# EAGLE schematic ddk-final-1 (EAGLE 6.4)
AUTHOR1: Dmitry Nedospasov; AUTHOR2: Thorsten Schröder; PROJECTREV: Octobus rev 0.2; WEB: http://github.com/ddk

## Sheet 1 of 5
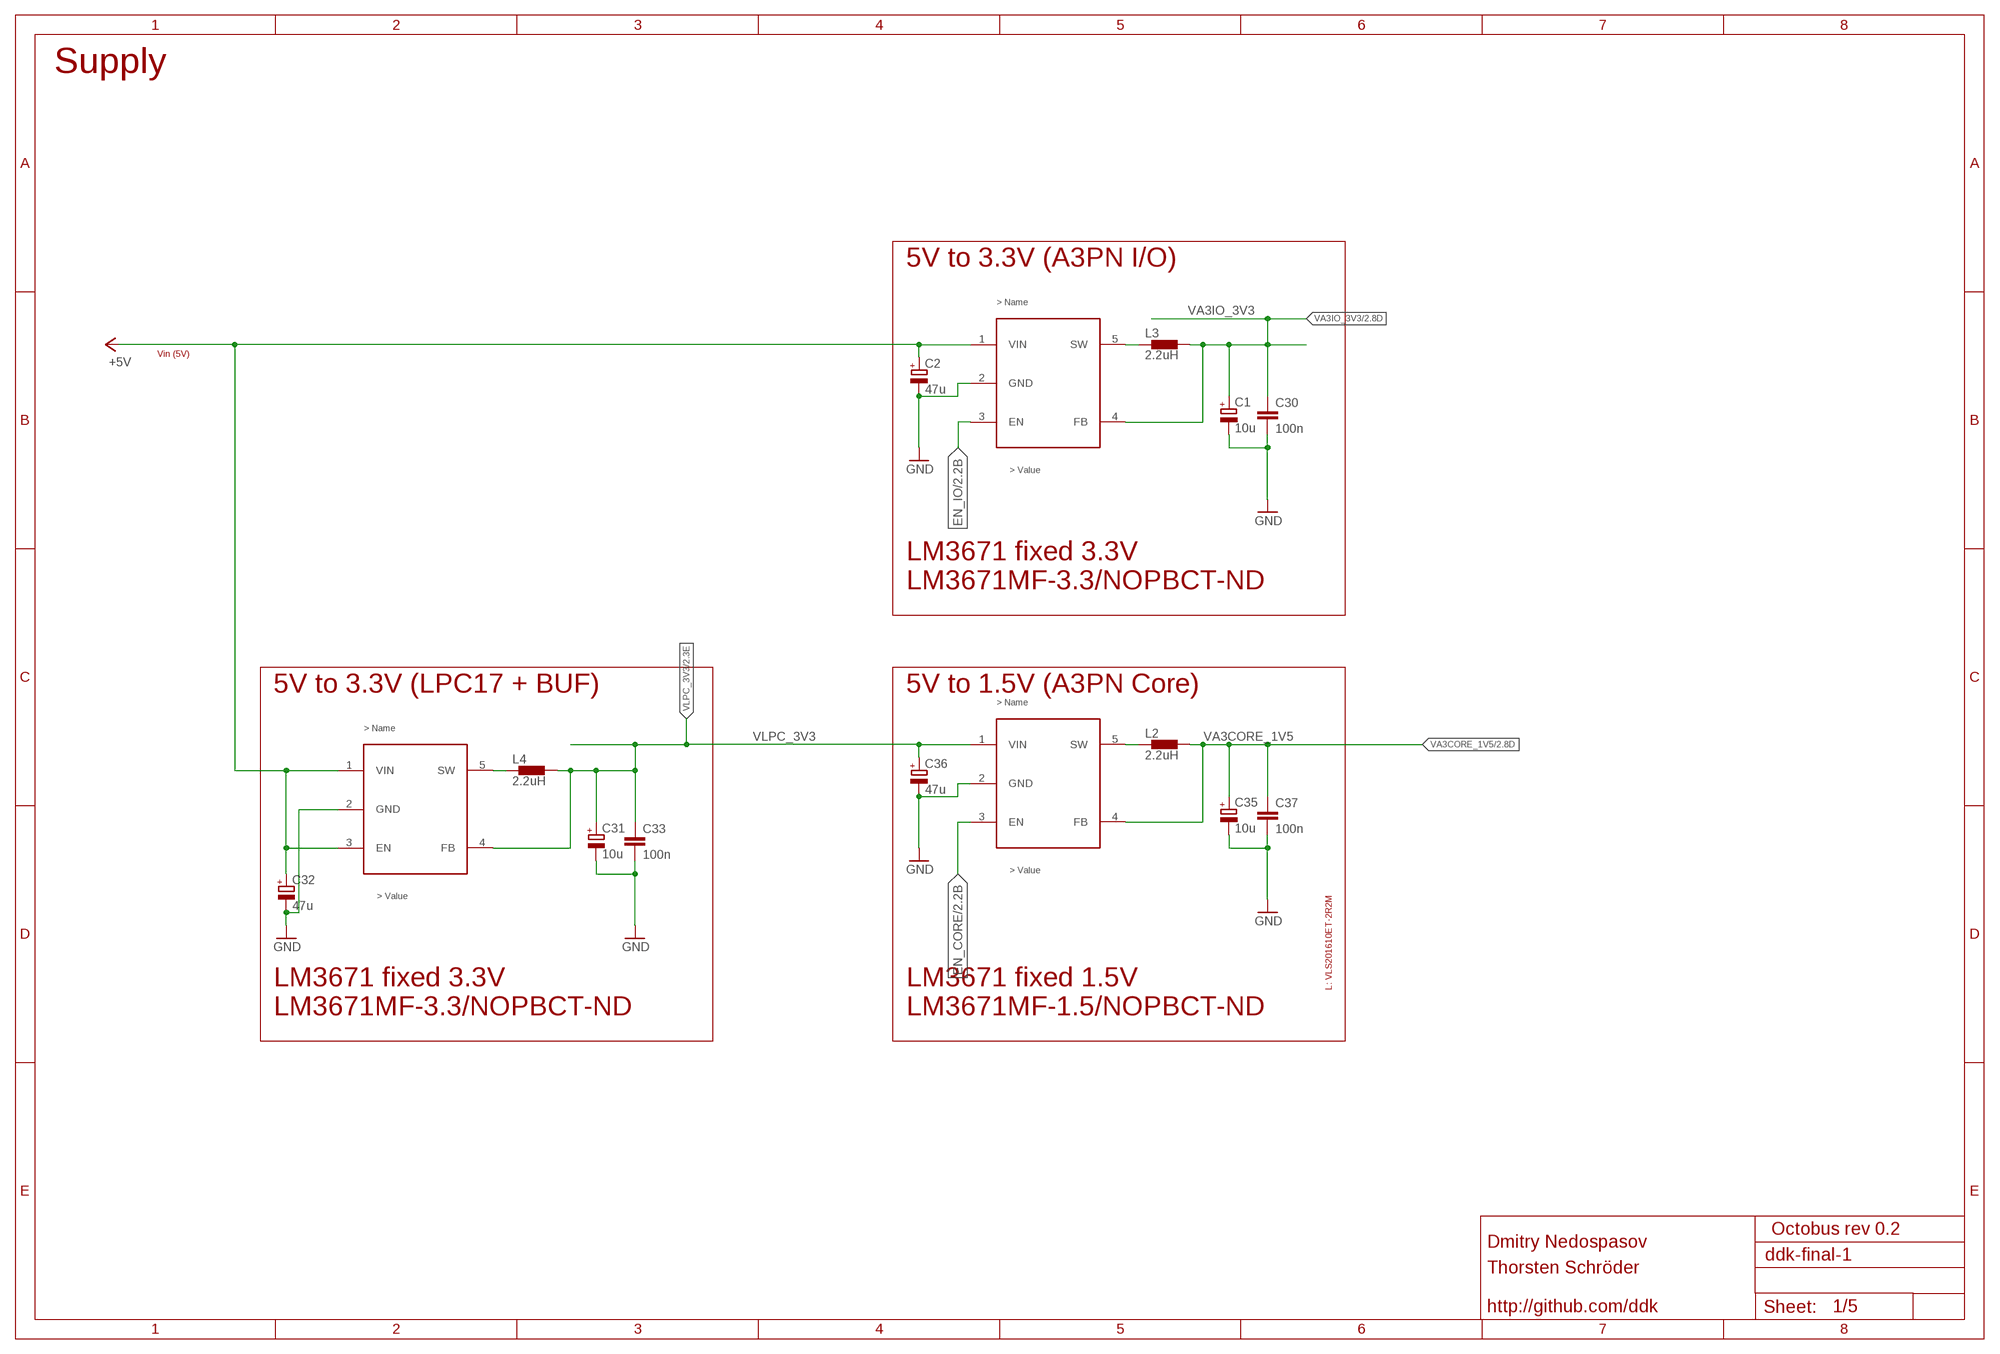
[diagram p0: schematic, sheet 1]

### Parts
C1  10u  CPOL-EUCT3216  [CT3216]
C2  47u  CPOL-EUCT3216  [CT3216]
C30  100n  C-EUC0603K  [C0603K]
C31  10u  CPOL-EUCT3216  [CT3216]
C32  47u  CPOL-EUCT3216  [CT3216]
C33  100n  C-EUC0603K  [C0603K]
C35  10u  CPOL-EUCT3216  [CT3216]
C36  47u  CPOL-EUCT3216  [CT3216]
C37  100n  C-EUC0603K  [C0603K]
L2  2.2uH  VLS201610E  [VLS_INDUCTOR]
L3  2.2uH  VLS201610E  [VLS_INDUCTOR]
L4  2.2uH  VLS201610E  [VLS_INDUCTOR]
LM1  LM3671_3V3IO  LM3671  [SOT23-5L]
LM2  LM3671_3V3_LPC  LM3671  [SOT23-5L]
LM3671  LM3671_1V5  LM3671  [SOT23-5L]

### Nets
+5V: C2.+ C32.+ LM1.1(VIN) LM2.1(VIN) LM2.3(EN) ; also sheet 3,5
EN_CORE: LM3671.3(EN) ; also sheet 2
EN_IO: LM1.3(EN) ; also sheet 2
GND: C1.- C2.- C30.2 C31.- C32.- C33.2 C35.- C36.- C37.2 LM1.2(GND) LM2.2(GND) LM3671.2(GND) ; also sheet 2,3,4,5
N$1: L2.P$1 LM3671.5(SW)
N$85: L3.P$1 LM1.5(SW)
N$86: L4.P$1 LM2.5(SW)
VA3CORE_1V5: C35.+ C37.1 L2.P$2 LM3671.4(FB) ; also sheet 2,5
VA3IO_3V3: C1.+ C30.1 L3.P$2 LM1.4(FB) ; also sheet 2,5
VLPC_3V3: C31.+ C33.1 C36.+ L4.P$2 LM2.4(FB) LM3671.1(VIN) ; also sheet 2,3,4,5

### Notes on the sheet
- Supply
- 5V to 3.3V (A3PN I/O)
- Vin (5V)
- LM3671 fixed 3.3V
  LM3671MF-3.3/NOPBCT-ND
- 5V to 3.3V (LPC17 + BUF) | 5V to 1.5V (A3PN Core)
- L: VLS201610ET-2R2M
- LM3671 fixed 3.3V
  LM3671MF-3.3/NOPBCT-ND
- LM3671 fixed 1.5V
  LM3671MF-1.5/NOPBCT-ND

## Sheet 2 of 5
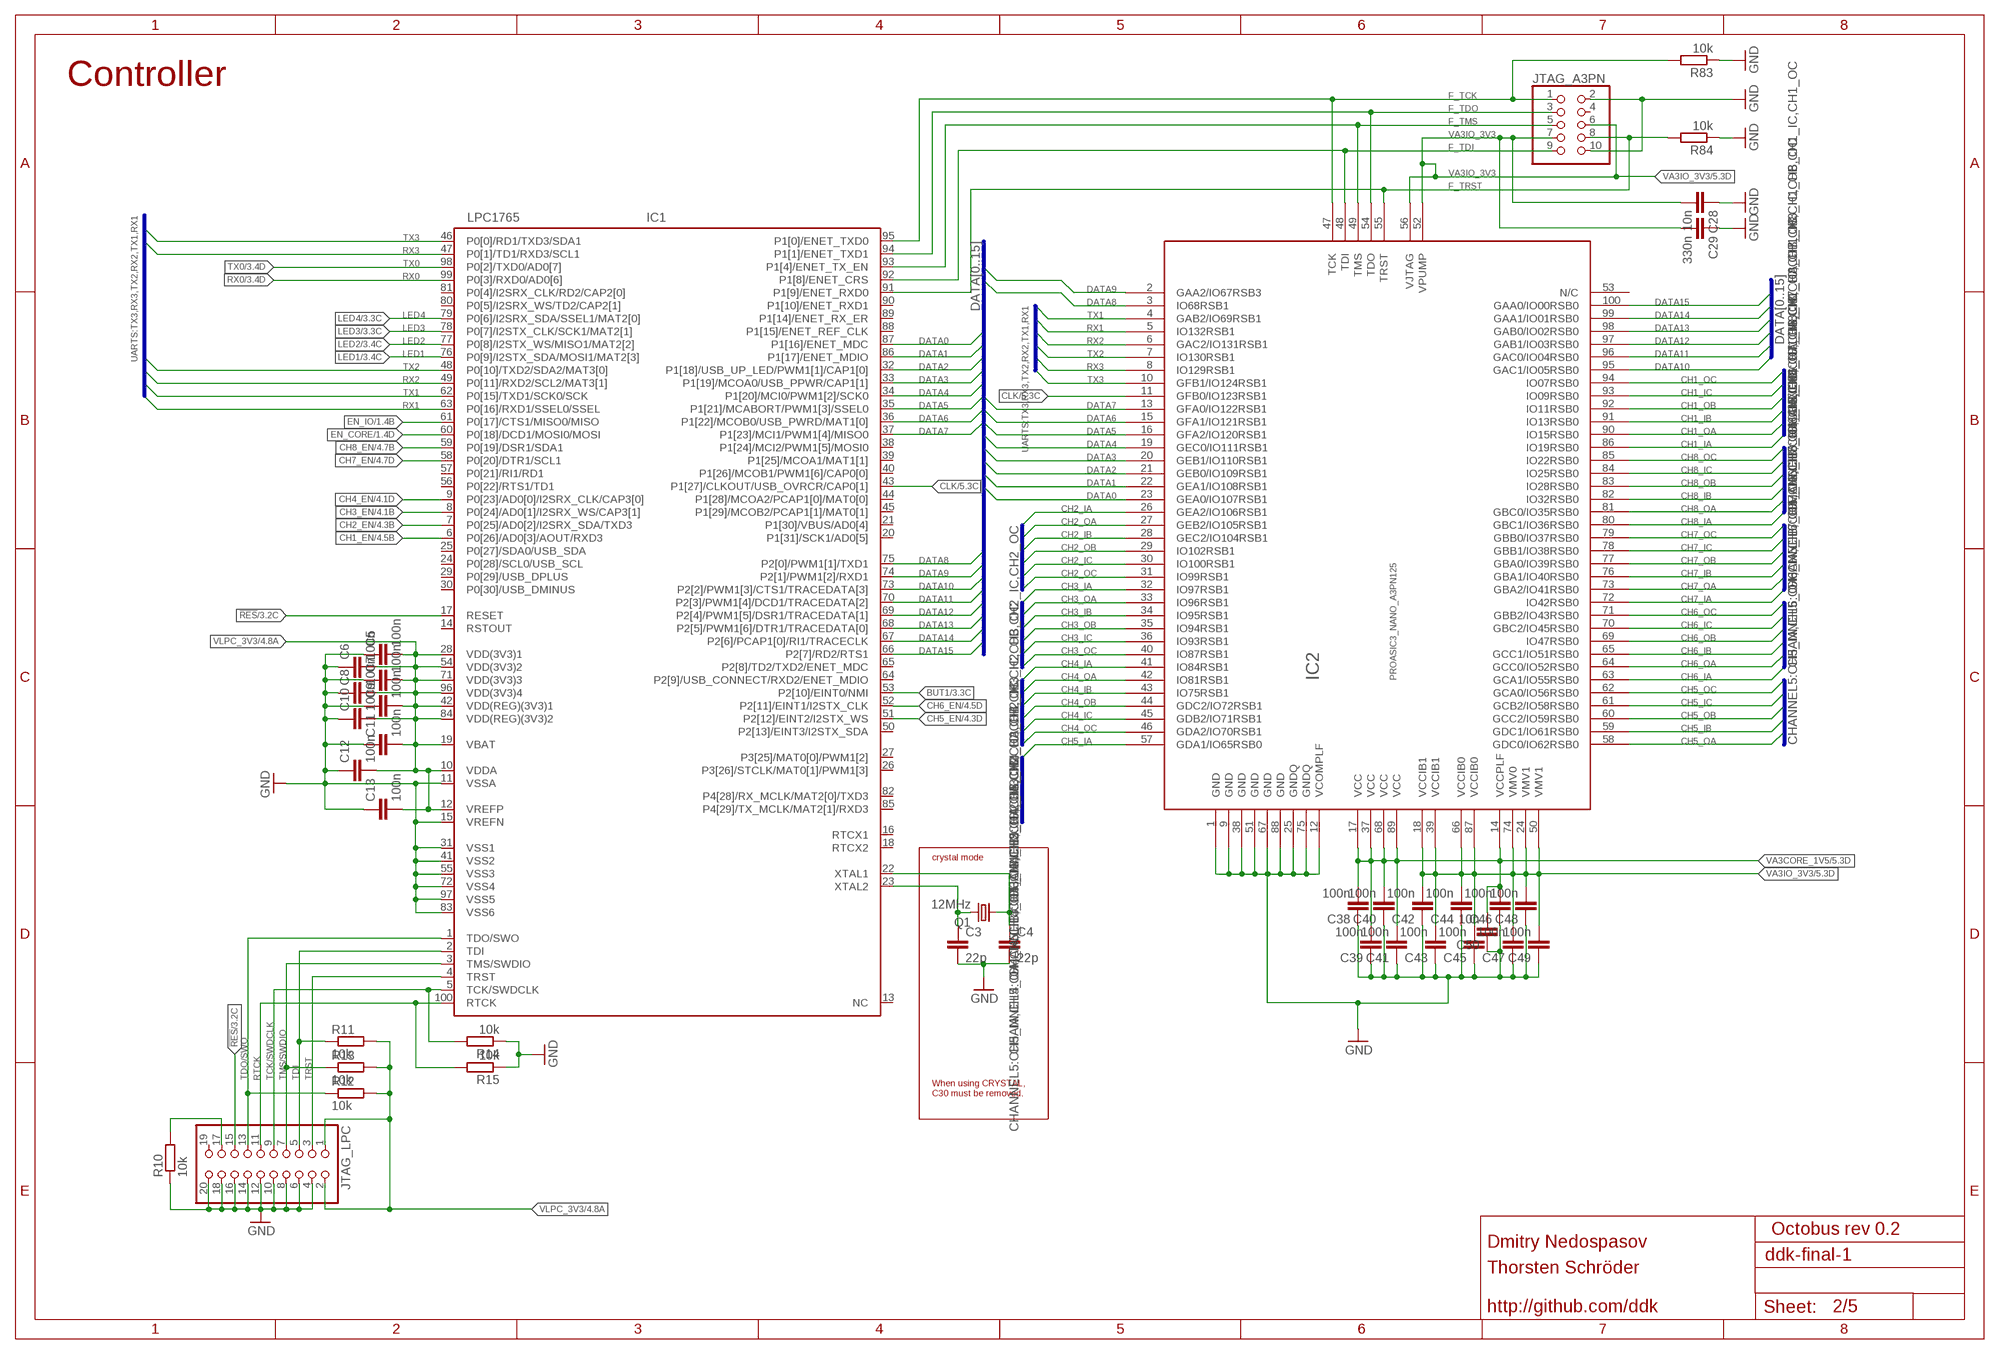
[diagram p1: schematic, sheet 2]

### Parts
C3  22p  C-EUC0603K  [C0603K]
C4  22p  C-EUC0603K  [C0603K]
C5  100n  C-EUC0603K  [C0603K]
C6  100n  C-EUC0603K  [C0603K]
C7  100n  C-EUC0603K  [C0603K]
C8  100n  C-EUC0603K  [C0603K]
C9  100n  C-EUC0603K  [C0603K]
C10  100n  C-EUC0603K  [C0603K]
C11  100n  C-EUC0603K  [C0603K]
C12  100n  C-EUC0603K  [C0603K]
C13  100n  C-EUC0603K  [C0603K]
C28  10n  C-EUC0603K  [C0603K]
C29  330n  C-EUC0603K  [C0603K]
C38  100n  C-EUC0603K  [C0603K]
C39  100n  C-EUC0603K  [C0603K]
C40  100n  C-EUC0603K  [C0603K]
C41  100n  C-EUC0603K  [C0603K]
C42  100n  C-EUC0603K  [C0603K]
C43  100n  C-EUC0603K  [C0603K]
C44  100n  C-EUC0603K  [C0603K]
C45  100n  C-EUC0603K  [C0603K]
C46  100n  C-EUC0603K  [C0603K]
C47  100n  C-EUC0603K  [C0603K]
C48  100n  C-EUC0603K  [C0603K]
C49  100n  C-EUC0603K  [C0603K]
C50  10n  C-EUC0603K  [C0603K]
IC1  LPC1765  [LQFP100-14X14]
IC2  PROASIC3_NANO_A3PN125  [VQFP100]
JTAG_A3PN  PINHD-2X05_2.54-SMD  [2X05SMD]
JTAG_LPC  PINHD-2X10_2.54-SMD  [2X10SMD]
Q1  12MHz  CRYSTALCTS406  [CTS406]
R10  10k  R-EU_R0603  [R0603]
R11  10k  R-EU_R0603  [R0603]
R12  10k  R-EU_R0603  [R0603]
R13  10k  R-EU_R0603  [R0603]
R14  10k  R-EU_R0603  [R0603]
R15  10k  R-EU_R0603  [R0603]
R83  10k  R-EU_R0603  [R0603]
R84  10k  R-EU_R0603  [R0603]

### Nets
!RES!: IC1.17(RESET) JTAG_LPC.15 ; also sheet 3
BUT1: IC1.53(P2[10]/EINT0/NMI) ; also sheet 3
CH1_EN: IC1.6(P0[26]/AD0[3]/AOUT/RXD3) ; also sheet 4
CH1_IA: IC2.86(IO19RSB0) ; also sheet 4
CH1_IB: IC2.91(IO13RSB0) ; also sheet 4
CH1_IC: IC2.93(IO09RSB0) ; also sheet 4
CH1_OA: IC2.90(IO15RSB0) ; also sheet 4
CH1_OB: IC2.92(IO11RSB0) ; also sheet 4
CH1_OC: IC2.94(IO07RSB0) ; also sheet 4
CH2_EN: IC1.7(P0[25]/AD0[2]/I2SRX_SDA/TXD3) ; also sheet 4
CH2_IA: IC2.26(GEA2/IO106RSB1) ; also sheet 4
CH2_IB: IC2.28(GEC2/IO104RSB1) ; also sheet 4
CH2_IC: IC2.30(IO100RSB1) ; also sheet 4
CH2_OA: IC2.27(GEB2/IO105RSB1) ; also sheet 4
CH2_OB: IC2.29(IO102RSB1) ; also sheet 4
CH2_OC: IC2.31(IO99RSB1) ; also sheet 4
CH3_EN: IC1.8(P0[24]/AD0[1]/I2SRX_WS/CAP3[1]) ; also sheet 4
CH3_IA: IC2.32(IO97RSB1) ; also sheet 4
CH3_IB: IC2.34(IO95RSB1) ; also sheet 4
CH3_IC: IC2.36(IO93RSB1) ; also sheet 4
CH3_OA: IC2.33(IO96RSB1) ; also sheet 4
CH3_OB: IC2.35(IO94RSB1) ; also sheet 4
CH3_OC: IC2.40(IO87RSB1) ; also sheet 4
CH4_EN: IC1.9(P0[23]/AD0[0]/I2SRX_CLK/CAP3[0]) ; also sheet 4
CH4_IA: IC2.41(IO84RSB1) ; also sheet 4
CH4_IB: IC2.43(IO75RSB1) ; also sheet 4
CH4_IC: IC2.45(GDB2/IO71RSB1) ; also sheet 4
CH4_OA: IC2.42(IO81RSB1) ; also sheet 4
CH4_OB: IC2.44(GDC2/IO72RSB1) ; also sheet 4
CH4_OC: IC2.46(GDA2/IO70RSB1) ; also sheet 4
CH5_EN: IC1.51(P2[12]/EINT2/I2STX_WS) ; also sheet 4
CH5_IA: IC2.57(GDA1/IO65RSB0) ; also sheet 4
CH5_IB: IC2.59(GDC1/IO61RSB0) ; also sheet 4
CH5_IC: IC2.61(GCB2/IO58RSB0) ; also sheet 4
CH5_OA: IC2.58(GDC0/IO62RSB0) ; also sheet 4
CH5_OB: IC2.60(GCC2/IO59RSB0) ; also sheet 4
CH5_OC: IC2.62(GCA0/IO56RSB0) ; also sheet 4
CH6_EN: IC1.52(P2[11]/EINT1/I2STX_CLK) ; also sheet 4
CH6_IA: IC2.63(GCA1/IO55RSB0) ; also sheet 4
CH6_IB: IC2.65(GCC1/IO51RSB0) ; also sheet 4
CH6_IC: IC2.70(GBC2/IO45RSB0) ; also sheet 4
CH6_OA: IC2.64(GCC0/IO52RSB0) ; also sheet 4
CH6_OB: IC2.69(IO47RSB0) ; also sheet 4
CH6_OC: IC2.71(GBB2/IO43RSB0) ; also sheet 4
CH7_EN: IC1.58(P0[20]/DTR1/SCL1) ; also sheet 4
CH7_IA: IC2.72(IO42RSB0) ; also sheet 4
CH7_IB: IC2.76(GBA1/IO40RSB0) ; also sheet 4
CH7_IC: IC2.78(GBB1/IO38RSB0) ; also sheet 4
CH7_OA: IC2.73(GBA2/IO41RSB0) ; also sheet 4
CH7_OB: IC2.77(GBA0/IO39RSB0) ; also sheet 4
CH7_OC: IC2.79(GBB0/IO37RSB0) ; also sheet 4
CH8_EN: IC1.59(P0[19]/DSR1/SDA1) ; also sheet 4
CH8_IA: IC2.80(GBC1/IO36RSB0) ; also sheet 4
CH8_IB: IC2.82(IO32RSB0) ; also sheet 4
CH8_IC: IC2.84(IO25RSB0) ; also sheet 4
CH8_OA: IC2.81(GBC0/IO35RSB0) ; also sheet 4
CH8_OB: IC2.83(IO28RSB0) ; also sheet 4
CH8_OC: IC2.85(IO22RSB0) ; also sheet 4
CLK: IC1.43(P1[27]/CLKOUT/USB_OVRCR/CAP0[1]) IC2.11(GFB0/IO123RSB1) ; also sheet 5
DATA0: IC1.87(P1[16]/ENET_MDC) IC2.23(GEA0/IO107RSB1)
DATA1: IC1.86(P1[17]/ENET_MDIO) IC2.22(GEA1/IO108RSB1)
DATA2: IC1.32(P1[18]/USB_UP_LED/PWM1[1]/CAP1[0]) IC2.21(GEB0/IO109RSB1)
DATA3: IC1.33(P1[19]/MCOA0/USB_PPWR/CAP1[1]) IC2.20(GEB1/IO110RSB1)
DATA4: IC1.34(P1[20]/MCI0/PWM1[2]/SCK0) IC2.19(GEC0/IO111RSB1)
DATA5: IC1.35(P1[21]/MCABORT/PWM1[3]/SSEL0) IC2.16(GFA2/IO120RSB1)
DATA6: IC1.36(P1[22]/MCOB0/USB_PWRD/MAT1[0]) IC2.15(GFA1/IO121RSB1)
DATA7: IC1.37(P1[23]/MCI1/PWM1[4]/MISO0) IC2.13(GFA0/IO122RSB1)
DATA8: IC1.75(P2[0]/PWM1[1]/TXD1) IC2.3(IO68RSB1)
DATA9: IC1.74(P2[1]/PWM1[2]/RXD1) IC2.2(GAA2/IO67RSB3)
DATA10: IC1.73(P2[2]/PWM1[3]/CTS1/TRACEDATA[3]) IC2.95(GAC1/IO05RSB0)
DATA11: IC1.70(P2[3]/PWM1[4]/DCD1/TRACEDATA[2]) IC2.96(GAC0/IO04RSB0)
DATA12: IC1.69(P2[4]/PWM1[5]/DSR1/TRACEDATA[1]) IC2.97(GAB1/IO03RSB0)
DATA13: IC1.68(P2[5]/PWM1[6]/DTR1/TRACEDATA[0]) IC2.98(GAB0/IO02RSB0)
DATA14: IC1.67(P2[6]/PCAP1[0]/RI1/TRACECLK) IC2.99(GAA1/IO01RSB0)
DATA15: IC1.66(P2[7]/RD2/RTS1) IC2.100(GAA0/IO00RSB0)
EN_CORE: IC1.60(P0[18]/DCD1/MOSI0/MOSI) ; also sheet 1
EN_IO: IC1.61(P0[17]/CTS1/MISO0/MISO) ; also sheet 1
F_TCK: IC1.95(P1[0]/ENET_TXD0) IC2.47(TCK) JTAG_A3PN.1 R83.2
F_TDI: IC1.92(P1[8]/ENET_CRS) IC2.48(TDI) JTAG_A3PN.9
F_TDO: IC1.94(P1[1]/ENET_TXD1) IC2.54(TDO) JTAG_A3PN.3
F_TMS: IC1.93(P1[4]/ENET_TX_EN) IC2.49(TMS) JTAG_A3PN.5
F_TRST: IC1.91(P1[9]/ENET_RXD0) IC2.55(TRST) JTAG_A3PN.8 R84.2
GND: C3.2 C4.2 C5.1 C6.1 C7.1 C8.1 C9.1 C10.1 C11.1 C12.1 C13.1 C28.1 C29.1 C38.1 C39.1 C40.1 C41.1 C42.1 C43.1 C44.1 C45.1 C46.1 C47.1 C48.1 C49.1 C50.1 IC1.11(VSSA) IC1.15(VREFN) IC1.31(VSS1) IC1.41(VSS2) IC1.55(VSS3) IC1.72(VSS4) IC1.83(VSS6) IC1.97(VSS5) IC2.1(GND) IC2.9(GND) IC2.12(VCOMPLF) IC2.25(GNDQ) IC2.38(GND) IC2.51(GND) IC2.67(GND) IC2.75(GNDQ) IC2.88(GND) JTAG_A3PN.2 JTAG_A3PN.10 JTAG_LPC.4 JTAG_LPC.6 JTAG_LPC.8 JTAG_LPC.10 JTAG_LPC.12 JTAG_LPC.14 JTAG_LPC.16 JTAG_LPC.18 JTAG_LPC.20 R10.1 R14.1 R15.1 R83.1 R84.1 ; also sheet 1,3,4,5
LED1: IC1.76(P0[9]/I2STX_SDA/MOSI1/MAT2[3]) ; also sheet 3
LED2: IC1.77(P0[8]/I2STX_WS/MISO1/MAT2[2]) ; also sheet 3
LED3: IC1.78(P0[7]/I2STX_CLK/SCK1/MAT2[1]) ; also sheet 3
LED4: IC1.79(P0[6]/I2SRX_SDA/SSEL1/MAT2[0]) ; also sheet 3
N$21: JTAG_LPC.17 R10.2
N$22: C4.1 IC1.22(XTAL1) Q1.1
N$23: C3.1 IC1.23(XTAL2) Q1.3
RTCK: IC1.100(RTCK) JTAG_LPC.11 R15.2
RX0: IC1.99(P0[3]/RXD0/AD0[6]) ; also sheet 3,5
RX1: IC1.63(P0[16]/RXD1/SSEL0/SSEL) IC2.5(IO132RSB1)
RX2: IC1.49(P0[11]/RXD2/SCL2/MAT3[1]) IC2.6(GAC2/IO131RSB1)
RX3: IC1.47(P0[1]/TD1/RXD3/SCL1) IC2.8(IO129RSB1)
TCK/SWDCLK: IC1.5(TCK/SWDCLK) JTAG_LPC.9 R14.2
TDI: IC1.2(TDI) JTAG_LPC.5 R11.1
TDO/SWO: IC1.1(TDO/SWO) JTAG_LPC.13 R12.1
TMS/SWDIO: IC1.3(TMS/SWDIO) JTAG_LPC.7 R13.1
TRST: IC1.4(TRST) JTAG_LPC.3
TX0: IC1.98(P0[2]/TXD0/AD0[7]) ; also sheet 3,5
TX1: IC1.62(P0[15]/TXD1/SCK0/SCK) IC2.4(GAB2/IO69RSB1)
TX2: IC1.48(P0[10]/TXD2/SDA2/MAT3[0]) IC2.7(IO130RSB1)
TX3: IC1.46(P0[0]/RD1/TXD3/SDA1) IC2.10(GFB1/IO124RSB1)
VA3CORE_1V5: C38.2 C39.2 C40.2 C41.2 C46.2 C50.2 IC2.14(VCCPLF) IC2.17(VCC) IC2.37(VCC) IC2.68(VCC) IC2.89(VCC) ; also sheet 1,5
VA3IO_3V3: C28.2 C29.2 C42.2 C43.2 C44.2 C45.2 C47.2 C48.2 C49.2 IC2.18(VCCIB1) IC2.24(VMV1) IC2.39(VCCIB1) IC2.50(VMV1) IC2.52(VPUMP) IC2.56(VJTAG) IC2.66(VCCIB0) IC2.74(VMV0) IC2.87(VCCIB0) JTAG_A3PN.6 JTAG_A3PN.7 ; also sheet 1,5
VLPC_3V3: C5.2 C6.2 C7.2 C8.2 C9.2 C10.2 C11.2 C12.2 C13.2 IC1.10(VDDA) IC1.12(VREFP) IC1.19(VBAT) IC1.28(VDD(3V3)1) IC1.42(VDD(REG)(3V3)1) IC1.54(VDD(3V3)2) IC1.71(VDD(3V3)3) IC1.84(VDD(REG)(3V3)2) IC1.96(VDD(3V3)4) JTAG_LPC.1 JTAG_LPC.2 R11.2 R12.2 R13.2 ; also sheet 1,3,4,5
Unconnected: IC1.13(NC) IC1.14(RSTOUT) IC1.16(RTCX1) IC1.18(RTCX2) IC1.20(P1[31]/SCK1/AD0[5]) IC1.21(P1[30]/VBUS/AD0[4]) IC1.24(P0[28]/SCL0/USB_SCL) IC1.25(P0[27]/SDA0/USB_SDA) IC1.26(P3[26]/STCLK/MAT0[1]/PWM1[3]) IC1.27(P3[25]/MAT0[0]/PWM1[2]) IC1.29(P0[29]/USB_DPLUS) IC1.30(P0[30]/USB_DMINUS) IC1.38(P1[24]/MCI2/PWM1[5]/MOSI0) IC1.39(P1[25]/MCOA1/MAT1[1]) IC1.40(P1[26]/MCOB1/PWM1[6]/CAP0[0]) IC1.44(P1[28]/MCOA2/PCAP1[0]/MAT0[0]) IC1.45(P1[29]/MCOB2/PCAP1[1]/MAT0[1]) IC1.50(P2[13]/EINT3/I2STX_SDA) IC1.56(P0[22]/RTS1/TD1) IC1.57(P0[21]/RI1/RD1) IC1.64(P2[9]/USB_CONNECT/RXD2/ENET_MDIO) IC1.65(P2[8]/TD2/TXD2/ENET_MDC) IC1.80(P0[5]/I2SRX_WS/TD2/CAP2[1]) IC1.81(P0[4]/I2SRX_CLK/RD2/CAP2[0]) IC1.82(P4[28]/RX_MCLK/MAT2[0]/TXD3) IC1.85(P4[29]/TX_MCLK/MAT2[1]/RXD3) IC1.88(P1[15]/ENET_REF_CLK) IC1.89(P1[14]/ENET_RX_ER) IC1.90(P1[10]/ENET_RXD1) IC2.53(N/C) JTAG_A3PN.4 JTAG_LPC.19

### Buses
DATA[0..15]
CHANNEL4:CH4_IA,CH4_OA,CH4_IB,CH4_OB,CH4_IC,CH4_OC
CHANNEL1:CH1_IA,CH1_OA,CH1_IB,CH1_OB,CH1_IC,CH1_OC
CHANNEL2:CH2_IA,CH2_OA,CH2_IB,CH2_OB,CH2_IC,CH2_OC
CHANNEL3:CH3_IA,CH3_OA,CH3_IB,CH3_OB,CH3_IC,CH3_OC
CHANNEL5:CH5_IA,CH5_OA,CH5_IB,CH5_OB,CH5_IC,CH5_OC
CHANNEL6:CH6_IA,CH6_OA,CH6_IB,CH6_OB,CH6_IC,CH6_OC
CHANNEL7:CH7_IA,CH7_OA,CH7_IB,CH7_OB,CH7_IC,CH7_OC
CHANNEL8:CH8_IA,CH8_OA,CH8_IB,CH8_OB,CH8_IC,CH8_OC
UARTS:TX3,RX3,TX2,RX2,TX1,RX1

### Notes on the sheet
- Controller
- crystal mode
- When using CRYSTAL, 
  C30 must be removed.

## Sheet 3 of 5
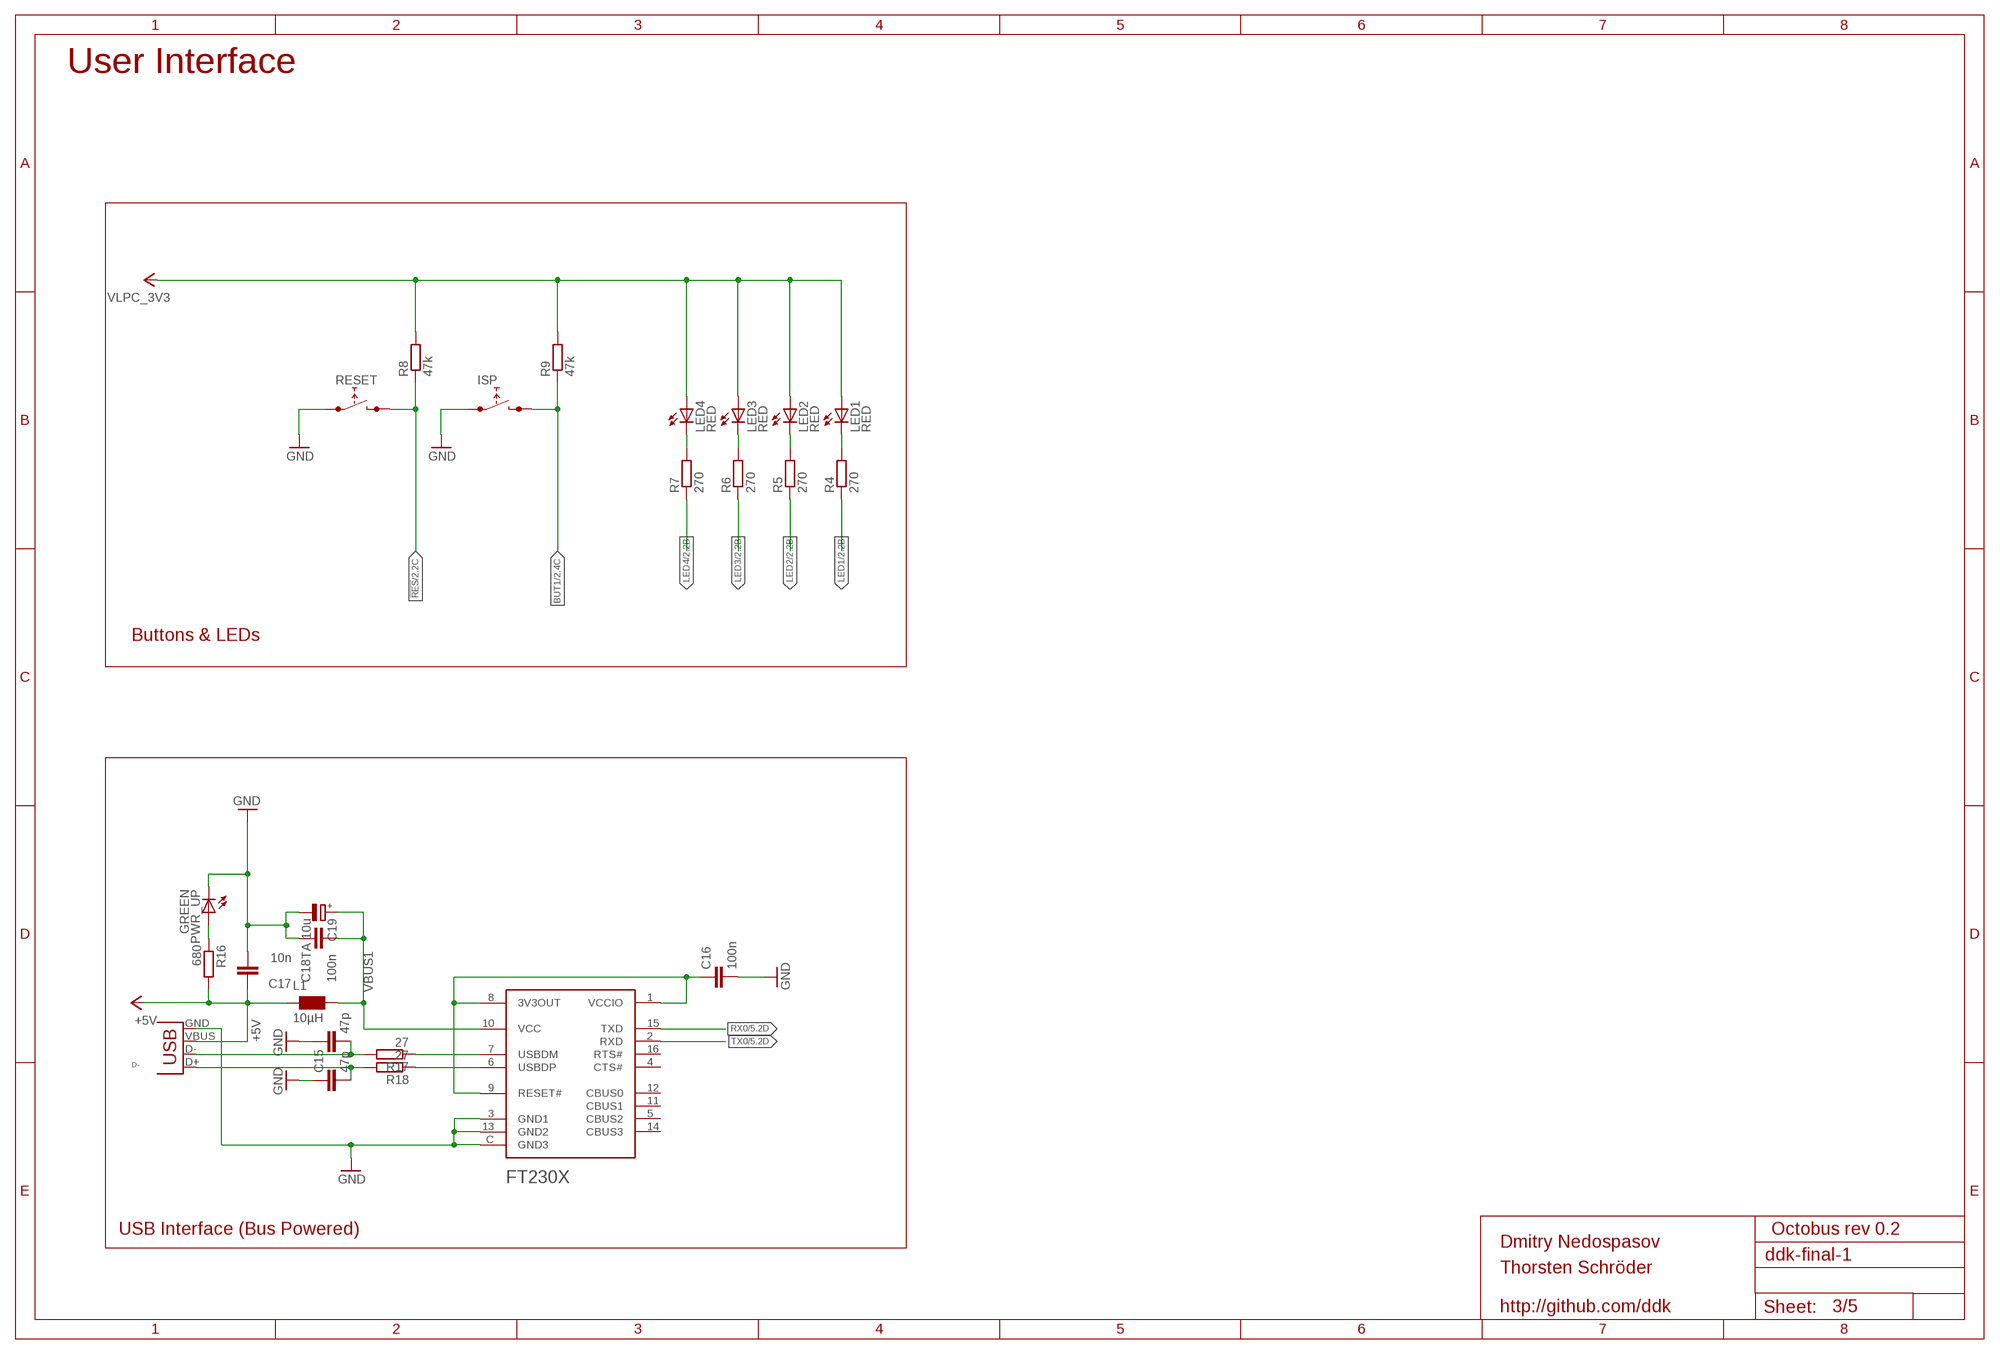
[diagram p2: schematic, sheet 3]

### Parts
C14  47p  C-EUC0603  [C0603]
C15  47p  C-EUC0603  [C0603]
C16  100n  C-EUC0603  [C0603]
C17  10n  C-EUC0603  [C0603]
C18  100n  C-EUC0603  [C0603]
C19  TA 10u  CPOL-EUCT3216  [CT3216]
FT230X  SERIAL_FT230XQ  [SERIAL_QFN4X4-16]
ISP  B3U-1000P  [B3U-1000P]
L1  10µH  WE-KI_0805_B  [WE-KI_0805_B]
LED1  RED  LEDCHIP-LED0603  [CHIP-LED0603]
LED2  RED  LEDCHIP-LED0603  [CHIP-LED0603]
LED3  RED  LEDCHIP-LED0603  [CHIP-LED0603]
LED4  RED  LEDCHIP-LED0603  [CHIP-LED0603]
PWR_UP  GREEN  LEDCHIPLED_0603  [CHIPLED_0603]
R4  270  R-EU_R0603  [R0603]
R5  270  R-EU_R0603  [R0603]
R6  270  R-EU_R0603  [R0603]
R7  270  R-EU_R0603  [R0603]
R8  47k  R-EU_R0603  [R0603]
R9  47k  R-EU_R0603  [R0603]
R16  680  R-EU_R0603  [R0603]
R17  27  R-EU_R0603  [R0603]
R18  27  R-EU_R0603  [R0603]
RESET  B3U-1000P  [B3U-1000P]
X1  USBSMD  [USB-MINIB]

### Nets
!RES!: R8.1 RESET.P$2 ; also sheet 2
+5V: C17.2 L1.2 R16.2 X1.VBUS ; also sheet 1,5
BUT1: ISP.P$2 R9.1 ; also sheet 2
D+: C14.1 R17.2 X1.D-
D-: C15.1 R18.2 X1.D+
GND: C14.2 C15.2 C16.1 C17.1 C18.2 C19.- FT230X.3(GND1) FT230X.13(GND2) FT230X.C(GND3) ISP.P$1 PWR_UP.C RESET.P$1 X1.GND ; also sheet 1,2,4,5
LED1: R4.1 ; also sheet 2
LED2: R5.1 ; also sheet 2
LED3: R6.1 ; also sheet 2
LED4: R7.1 ; also sheet 2
N$20: FT230X.6(USBDP) R18.1
N$24: FT230X.7(USBDM) R17.1
N$25: LED4.C R7.2
N$26: LED3.C R6.2
N$27: LED2.C R5.2
N$28: LED1.C R4.2
N$29: C16.2 FT230X.1(VCCIO) FT230X.8(3V3OUT) FT230X.9(RESET#)
N$30: PWR_UP.A R16.1
RX0: FT230X.15(TXD) ; also sheet 2,5
TX0: FT230X.2(RXD) ; also sheet 2,5
VBUS1: C18.1 C19.+ FT230X.10(VCC) L1.1
VLPC_3V3: LED1.A LED2.A LED3.A LED4.A R8.2 R9.2 ; also sheet 1,2,4,5
Unconnected: FT230X.4(CTS#) FT230X.5(CBUS2) FT230X.11(CBUS1) FT230X.12(CBUS0) FT230X.14(CBUS3) FT230X.16(RTS#)

### Notes on the sheet
- User Interface
- Buttons & LEDs
- USB Interface (Bus Powered)

## Sheet 4 of 5
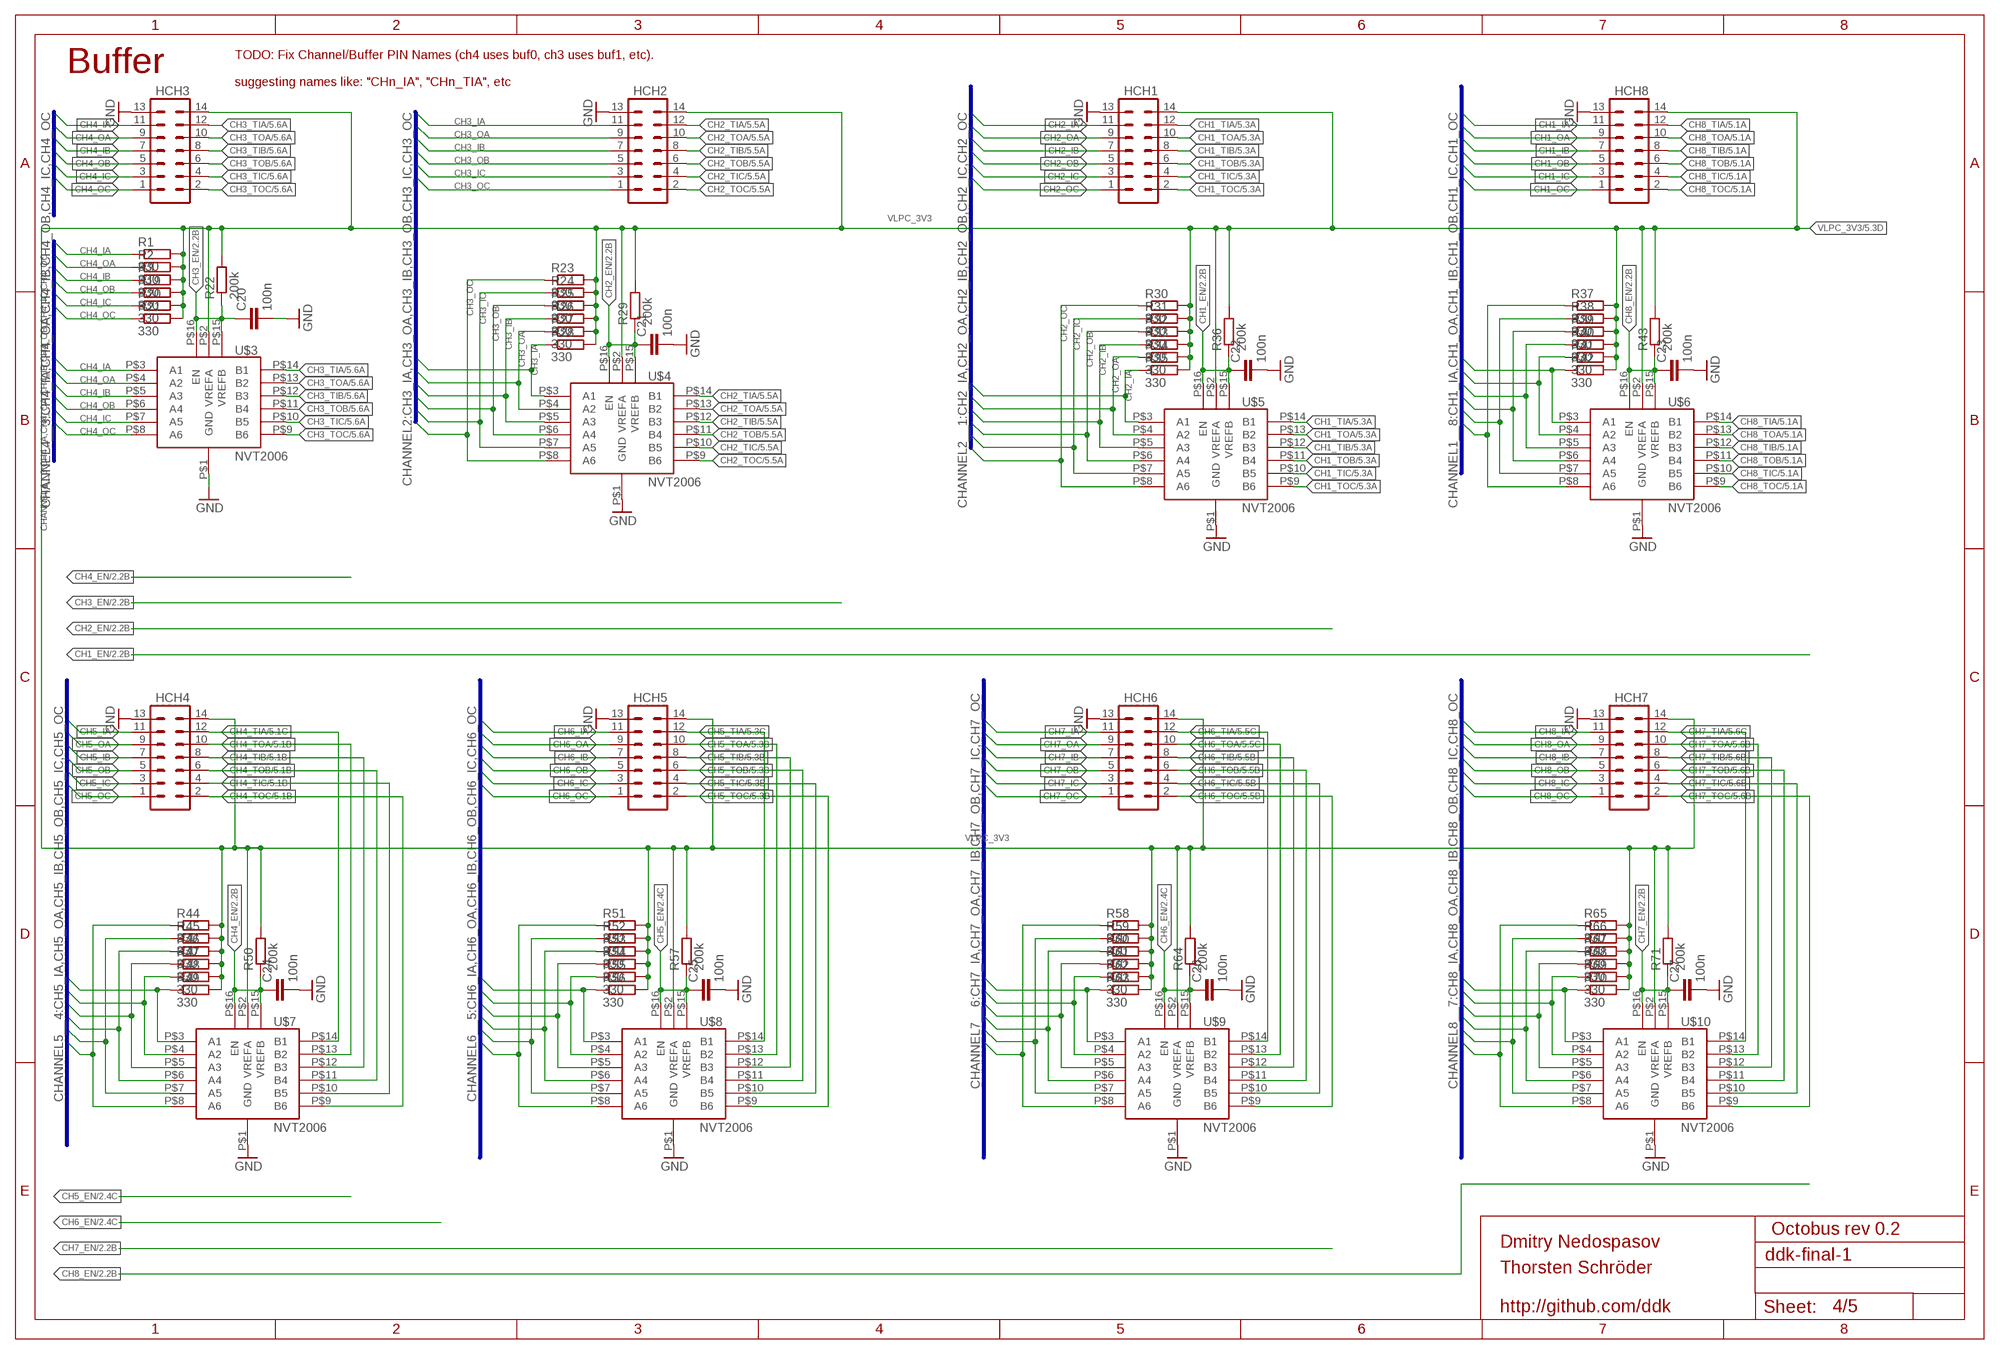
[diagram p3: schematic, sheet 4]

### Parts
C20  100n  C-EUC0603  [C0603]
C21  100n  C-EUC0603  [C0603]
C22  100n  C-EUC0603  [C0603]
C23  100n  C-EUC0603  [C0603]
C24  100n  C-EUC0603  [C0603]
C25  100n  C-EUC0603  [C0603]
C26  100n  C-EUC0603  [C0603]
C27  100n  C-EUC0603  [C0603]
HCH1  MA07-2  [MA07-2]
HCH2  MA07-2  [MA07-2]
HCH3  MA07-2  [MA07-2]
HCH4  MA07-2  [MA07-2]
HCH5  MA07-2  [MA07-2]
HCH6  MA07-2  [MA07-2]
HCH7  MA07-2  [MA07-2]
HCH8  MA07-2  [MA07-2]
R1  330  R-EU_R0603  [R0603]
R2  330  R-EU_R0603  [R0603]
R3  330  R-EU_R0603  [R0603]
R19  330  R-EU_R0603  [R0603]
R20  330  R-EU_R0603  [R0603]
R21  330  R-EU_R0603  [R0603]
R22  200k  R-EU_R0603  [R0603]
R23  330  R-EU_R0603  [R0603]
R24  330  R-EU_R0603  [R0603]
R25  330  R-EU_R0603  [R0603]
R26  330  R-EU_R0603  [R0603]
R27  330  R-EU_R0603  [R0603]
R28  330  R-EU_R0603  [R0603]
R29  200k  R-EU_R0603  [R0603]
R30  330  R-EU_R0603  [R0603]
R31  330  R-EU_R0603  [R0603]
R32  330  R-EU_R0603  [R0603]
R33  330  R-EU_R0603  [R0603]
R34  330  R-EU_R0603  [R0603]
R35  330  R-EU_R0603  [R0603]
R36  200k  R-EU_R0603  [R0603]
R37  330  R-EU_R0603  [R0603]
R38  330  R-EU_R0603  [R0603]
R39  330  R-EU_R0603  [R0603]
R40  330  R-EU_R0603  [R0603]
R41  330  R-EU_R0603  [R0603]
R42  330  R-EU_R0603  [R0603]
R43  200k  R-EU_R0603  [R0603]
R44  330  R-EU_R0603  [R0603]
R45  330  R-EU_R0603  [R0603]
R46  330  R-EU_R0603  [R0603]
R47  330  R-EU_R0603  [R0603]
R48  330  R-EU_R0603  [R0603]
R49  330  R-EU_R0603  [R0603]
R50  200k  R-EU_R0603  [R0603]
R51  330  R-EU_R0603  [R0603]
R52  330  R-EU_R0603  [R0603]
R53  330  R-EU_R0603  [R0603]
R54  330  R-EU_R0603  [R0603]
R55  330  R-EU_R0603  [R0603]
R56  330  R-EU_R0603  [R0603]
R57  200k  R-EU_R0603  [R0603]
R58  330  R-EU_R0603  [R0603]
R59  330  R-EU_R0603  [R0603]
R60  330  R-EU_R0603  [R0603]
R61  330  R-EU_R0603  [R0603]
R62  330  R-EU_R0603  [R0603]
R63  330  R-EU_R0603  [R0603]
R64  200k  R-EU_R0603  [R0603]
R65  330  R-EU_R0603  [R0603]
R66  330  R-EU_R0603  [R0603]
R67  330  R-EU_R0603  [R0603]
R68  330  R-EU_R0603  [R0603]
R69  330  R-EU_R0603  [R0603]
R70  330  R-EU_R0603  [R0603]
R71  200k  R-EU_R0603  [R0603]
U$3  NVT2006  [TSSOP16]
U$4  NVT2006  [TSSOP16]
U$5  NVT2006  [TSSOP16]
U$6  NVT2006  [TSSOP16]
U$7  NVT2006  [TSSOP16]
U$8  NVT2006  [TSSOP16]
U$9  NVT2006  [TSSOP16]
U$10  NVT2006  [TSSOP16]

### Nets
CH1_EN: C22.1 R36.1 U$5.P$15(VREFB) U$5.P$16(EN) ; also sheet 2
CH1_IA: HCH8.11 R42.1 U$6.P$3(A1) ; also sheet 2
CH1_IB: HCH8.7 R40.1 U$6.P$5(A3) ; also sheet 2
CH1_IC: HCH8.3 R38.1 U$6.P$7(A5) ; also sheet 2
CH1_OA: HCH8.9 R41.1 U$6.P$4(A2) ; also sheet 2
CH1_OB: HCH8.5 R39.1 U$6.P$6(A4) ; also sheet 2
CH1_OC: HCH8.1 R37.1 U$6.P$8(A6) ; also sheet 2
CH1_TIA: HCH1.12 U$5.P$14(B1) ; also sheet 5
CH1_TIB: HCH1.8 U$5.P$12(B3) ; also sheet 5
CH1_TIC: HCH1.4 U$5.P$10(B5) ; also sheet 5
CH1_TOA: HCH1.10 U$5.P$13(B2) ; also sheet 5
CH1_TOB: HCH1.6 U$5.P$11(B4) ; also sheet 5
CH1_TOC: HCH1.2 U$5.P$9(B6) ; also sheet 5
CH2_EN: C21.1 R29.1 U$4.P$15(VREFB) U$4.P$16(EN) ; also sheet 2
CH2_IA: HCH1.11 R35.1 U$5.P$3(A1) ; also sheet 2
CH2_IB: HCH1.7 R33.1 U$5.P$5(A3) ; also sheet 2
CH2_IC: HCH1.3 R31.1 U$5.P$7(A5) ; also sheet 2
CH2_OA: HCH1.9 R34.1 U$5.P$4(A2) ; also sheet 2
CH2_OB: HCH1.5 R32.1 U$5.P$6(A4) ; also sheet 2
CH2_OC: HCH1.1 R30.1 U$5.P$8(A6) ; also sheet 2
CH2_TIA: HCH2.12 U$4.P$14(B1) ; also sheet 5
CH2_TIB: HCH2.8 U$4.P$12(B3) ; also sheet 5
CH2_TIC: HCH2.4 U$4.P$10(B5) ; also sheet 5
CH2_TOA: HCH2.10 U$4.P$13(B2) ; also sheet 5
CH2_TOB: HCH2.6 U$4.P$11(B4) ; also sheet 5
CH2_TOC: HCH2.2 U$4.P$9(B6) ; also sheet 5
CH3_EN: C20.1 R22.1 U$3.P$15(VREFB) U$3.P$16(EN) ; also sheet 2
CH3_IA: HCH2.11 R28.1 U$4.P$3(A1) ; also sheet 2
CH3_IB: HCH2.7 R26.1 U$4.P$5(A3) ; also sheet 2
CH3_IC: HCH2.3 R24.1 U$4.P$7(A5) ; also sheet 2
CH3_OA: HCH2.9 R27.1 U$4.P$4(A2) ; also sheet 2
CH3_OB: HCH2.5 R25.1 U$4.P$6(A4) ; also sheet 2
CH3_OC: HCH2.1 R23.1 U$4.P$8(A6) ; also sheet 2
CH3_TIA: HCH3.12 U$3.P$14(B1) ; also sheet 5
CH3_TIB: HCH3.8 U$3.P$12(B3) ; also sheet 5
CH3_TIC: HCH3.4 U$3.P$10(B5) ; also sheet 5
CH3_TOA: HCH3.10 U$3.P$13(B2) ; also sheet 5
CH3_TOB: HCH3.6 U$3.P$11(B4) ; also sheet 5
CH3_TOC: HCH3.2 U$3.P$9(B6) ; also sheet 5
CH4_EN: C24.1 R50.1 U$7.P$15(VREFB) U$7.P$16(EN) ; also sheet 2
CH4_IA: HCH3.11 R1.1 U$3.P$3(A1) ; also sheet 2
CH4_IB: HCH3.7 R3.1 U$3.P$5(A3) ; also sheet 2
CH4_IC: HCH3.3 R20.1 U$3.P$7(A5) ; also sheet 2
CH4_OA: HCH3.9 R2.1 U$3.P$4(A2) ; also sheet 2
CH4_OB: HCH3.5 R19.1 U$3.P$6(A4) ; also sheet 2
CH4_OC: HCH3.1 R21.1 U$3.P$8(A6) ; also sheet 2
CH4_TIA: HCH4.12 U$7.P$14(B1) ; also sheet 5
CH4_TIB: HCH4.8 U$7.P$12(B3) ; also sheet 5
CH4_TIC: HCH4.4 U$7.P$10(B5) ; also sheet 5
CH4_TOA: HCH4.10 U$7.P$13(B2) ; also sheet 5
CH4_TOB: HCH4.6 U$7.P$11(B4) ; also sheet 5
CH4_TOC: HCH4.2 U$7.P$9(B6) ; also sheet 5
CH5_EN: C25.1 R57.1 U$8.P$15(VREFB) U$8.P$16(EN) ; also sheet 2
CH5_IA: HCH4.11 R49.1 U$7.P$3(A1) ; also sheet 2
CH5_IB: HCH4.7 R47.1 U$7.P$5(A3) ; also sheet 2
CH5_IC: HCH4.3 R45.1 U$7.P$7(A5) ; also sheet 2
CH5_OA: HCH4.9 R48.1 U$7.P$4(A2) ; also sheet 2
CH5_OB: HCH4.5 R46.1 U$7.P$6(A4) ; also sheet 2
CH5_OC: HCH4.1 R44.1 U$7.P$8(A6) ; also sheet 2
CH5_TIA: HCH5.12 U$8.P$14(B1) ; also sheet 5
CH5_TIB: HCH5.8 U$8.P$12(B3) ; also sheet 5
CH5_TIC: HCH5.4 U$8.P$10(B5) ; also sheet 5
CH5_TOA: HCH5.10 U$8.P$13(B2) ; also sheet 5
CH5_TOB: HCH5.6 U$8.P$11(B4) ; also sheet 5
CH5_TOC: HCH5.2 U$8.P$9(B6) ; also sheet 5
CH6_EN: C26.1 R64.1 U$9.P$15(VREFB) U$9.P$16(EN) ; also sheet 2
CH6_IA: HCH5.11 R56.1 U$8.P$3(A1) ; also sheet 2
CH6_IB: HCH5.7 R54.1 U$8.P$5(A3) ; also sheet 2
CH6_IC: HCH5.3 R52.1 U$8.P$7(A5) ; also sheet 2
CH6_OA: HCH5.9 R55.1 U$8.P$4(A2) ; also sheet 2
CH6_OB: HCH5.5 R53.1 U$8.P$6(A4) ; also sheet 2
CH6_OC: HCH5.1 R51.1 U$8.P$8(A6) ; also sheet 2
CH6_TIA: HCH6.12 U$9.P$14(B1) ; also sheet 5
CH6_TIB: HCH6.8 U$9.P$12(B3) ; also sheet 5
CH6_TIC: HCH6.4 U$9.P$10(B5) ; also sheet 5
CH6_TOA: HCH6.10 U$9.P$13(B2) ; also sheet 5
CH6_TOB: HCH6.6 U$9.P$11(B4) ; also sheet 5
CH6_TOC: HCH6.2 U$9.P$9(B6) ; also sheet 5
CH7_EN: C27.1 R71.1 U$10.P$15(VREFB) U$10.P$16(EN) ; also sheet 2
CH7_IA: HCH6.11 R63.1 U$9.P$3(A1) ; also sheet 2
CH7_IB: HCH6.7 R61.1 U$9.P$5(A3) ; also sheet 2
CH7_IC: HCH6.3 R59.1 U$9.P$7(A5) ; also sheet 2
CH7_OA: HCH6.9 R62.1 U$9.P$4(A2) ; also sheet 2
CH7_OB: HCH6.5 R60.1 U$9.P$6(A4) ; also sheet 2
CH7_OC: HCH6.1 R58.1 U$9.P$8(A6) ; also sheet 2
CH7_TIA: HCH7.12 U$10.P$14(B1) ; also sheet 5
CH7_TIB: HCH7.8 U$10.P$12(B3) ; also sheet 5
CH7_TIC: HCH7.4 U$10.P$10(B5) ; also sheet 5
CH7_TOA: HCH7.10 U$10.P$13(B2) ; also sheet 5
CH7_TOB: HCH7.6 U$10.P$11(B4) ; also sheet 5
CH7_TOC: HCH7.2 U$10.P$9(B6) ; also sheet 5
CH8_EN: C23.1 R43.1 U$6.P$15(VREFB) U$6.P$16(EN) ; also sheet 2
CH8_IA: HCH7.11 R70.1 U$10.P$3(A1) ; also sheet 2
CH8_IB: HCH7.7 R68.1 U$10.P$5(A3) ; also sheet 2
CH8_IC: HCH7.3 R66.1 U$10.P$7(A5) ; also sheet 2
CH8_OA: HCH7.9 R69.1 U$10.P$4(A2) ; also sheet 2
CH8_OB: HCH7.5 R67.1 U$10.P$6(A4) ; also sheet 2
CH8_OC: HCH7.1 R65.1 U$10.P$8(A6) ; also sheet 2
CH8_TIA: HCH8.12 U$6.P$14(B1) ; also sheet 5
CH8_TIB: HCH8.8 U$6.P$12(B3) ; also sheet 5
CH8_TIC: HCH8.4 U$6.P$10(B5) ; also sheet 5
CH8_TOA: HCH8.10 U$6.P$13(B2) ; also sheet 5
CH8_TOB: HCH8.6 U$6.P$11(B4) ; also sheet 5
CH8_TOC: HCH8.2 U$6.P$9(B6) ; also sheet 5
GND: C20.2 C21.2 C22.2 C23.2 C24.2 C25.2 C26.2 C27.2 HCH1.13 HCH2.13 HCH3.13 HCH4.13 HCH5.13 HCH6.13 HCH7.13 HCH8.13 U$3.P$1(GND) U$4.P$1(GND) U$5.P$1(GND) U$6.P$1(GND) U$7.P$1(GND) U$8.P$1(GND) U$9.P$1(GND) U$10.P$1(GND) ; also sheet 1,2,3,5
VLPC_3V3: HCH1.14 HCH2.14 HCH3.14 HCH4.14 HCH5.14 HCH6.14 HCH7.14 HCH8.14 R1.2 R2.2 R3.2 R19.2 R20.2 R21.2 R22.2 R23.2 R24.2 R25.2 R26.2 R27.2 R28.2 R29.2 R30.2 R31.2 R32.2 R33.2 R34.2 R35.2 R36.2 R37.2 R38.2 R39.2 R40.2 R41.2 R42.2 R43.2 R44.2 R45.2 R46.2 R47.2 R48.2 R49.2 R50.2 R51.2 R52.2 R53.2 R54.2 R55.2 R56.2 R57.2 R58.2 R59.2 R60.2 R61.2 R62.2 R63.2 R64.2 R65.2 R66.2 R67.2 R68.2 R69.2 R70.2 R71.2 U$3.P$2(VREFA) U$4.P$2(VREFA) U$5.P$2(VREFA) U$6.P$2(VREFA) U$7.P$2(VREFA) U$8.P$2(VREFA) U$9.P$2(VREFA) U$10.P$2(VREFA) ; also sheet 1,2,3,5

### Buses
CHANNEL4:CH4_IA,CH4_OA,CH4_IB,CH4_OB,CH4_IC,CH4_OC
CHANNEL2:CH3_IA,CH3_OA,CH3_IB,CH3_OB,CH3_IC,CH3_OC
CHANNEL2__1:CH2_IA,CH2_OA,CH2_IB,CH2_OB,CH2_IC,CH2_OC
CHANNEL5__4:CH5_IA,CH5_OA,CH5_IB,CH5_OB,CH5_IC,CH5_OC
CHANNEL6__5:CH6_IA,CH6_OA,CH6_IB,CH6_OB,CH6_IC,CH6_OC
CHANNEL7__6:CH7_IA,CH7_OA,CH7_IB,CH7_OB,CH7_IC,CH7_OC
CHANNEL8__7:CH8_IA,CH8_OA,CH8_IB,CH8_OB,CH8_IC,CH8_OC
CHANNEL1__8:CH1_IA,CH1_OA,CH1_IB,CH1_OB,CH1_IC,CH1_OC
CHANNEL4__3:CH4_IA,CH4_OA,CH4_IB,CH4_OB,CH4_IC,CH4_OC

### Notes on the sheet
- Buffer
- TODO: Fix Channel/Buffer PIN Names (ch4 uses buf0, ch3 uses buf1, etc).
  
  suggesting names like: "CHn_IA", "CHn_TIA", etc

## Sheet 5 of 5
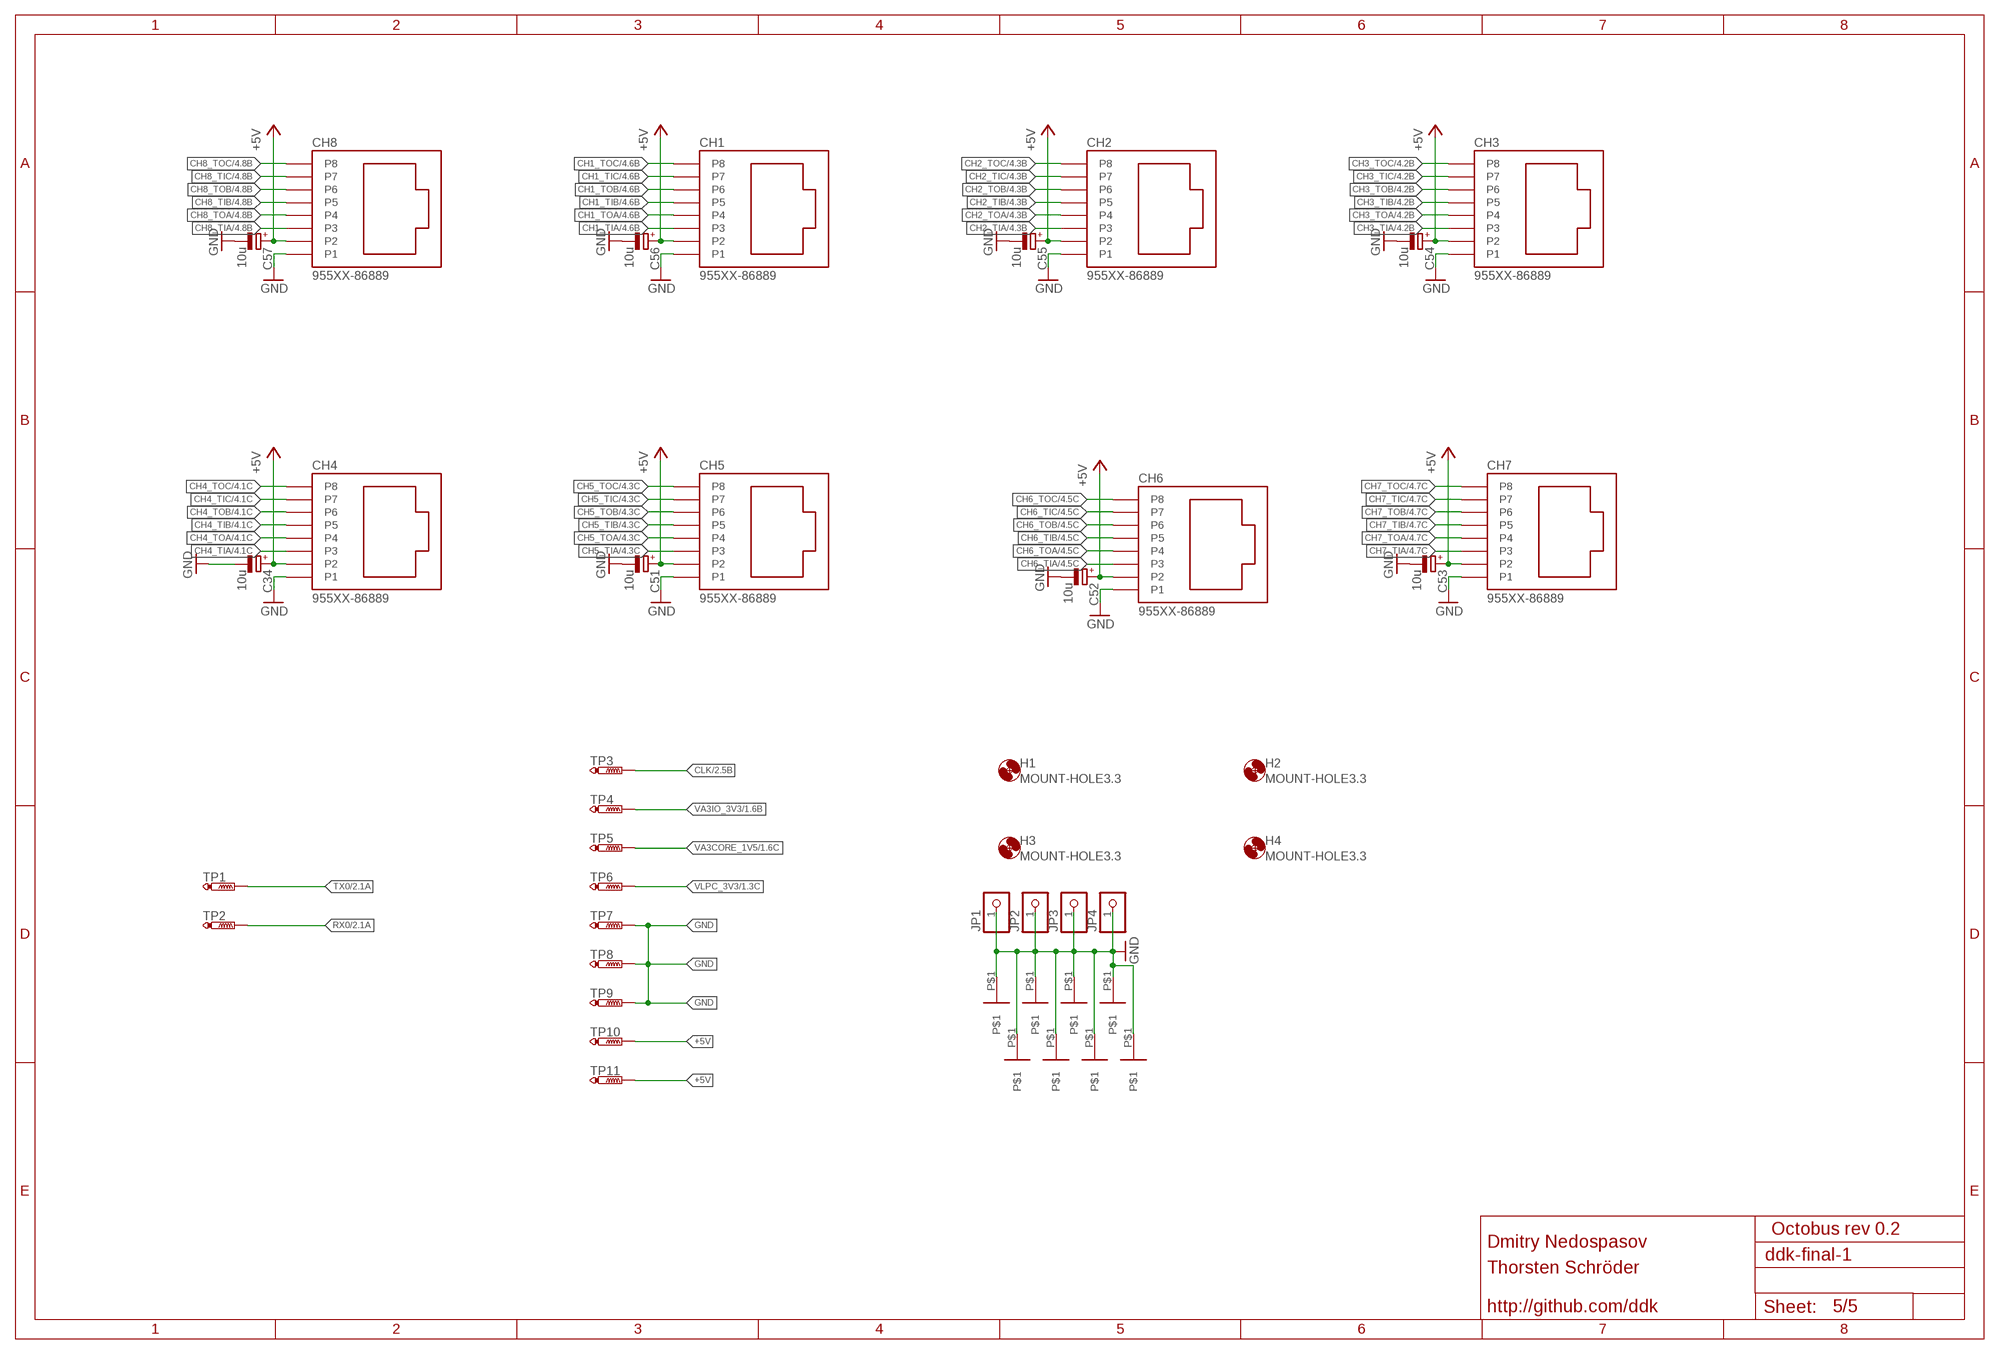
[diagram p4: schematic, sheet 5]

### Parts
C34  10u  CPOL-EUCT3216  [CT3216]
C51  10u  CPOL-EUCT3216  [CT3216]
C52  10u  CPOL-EUCT3216  [CT3216]
C53  10u  CPOL-EUCT3216  [CT3216]
C54  10u  CPOL-EUCT3216  [CT3216]
C55  10u  CPOL-EUCT3216  [CT3216]
C56  10u  CPOL-EUCT3216  [CT3216]
C57  10u  CPOL-EUCT3216  [CT3216]
CH1  955XX-86889  [95501]
CH2  955XX-86889  [95501]
CH3  955XX-86889  [95501]
CH4  955XX-86889  [95501]
CH5  955XX-86889  [95501]
CH6  955XX-86889  [95501]
CH7  955XX-86889  [95501]
CH8  955XX-86889  [95501]
H1  MOUNT-HOLE3.3  [3,3]
H2  MOUNT-HOLE3.3  [3,3]
H3  MOUNT-HOLE3.3  [3,3]
H4  MOUNT-HOLE3.3  [3,3]
JP1  PINHD-1X1  [1X01]
JP2  PINHD-1X1  [1X01]
JP3  PINHD-1X1  [1X01]
JP4  PINHD-1X1  [1X01]
TP1  PTR1B1,27  [B1,27]
TP2  PTR1B1,27  [B1,27]
TP3  PTR1TP08R  [TP08R]
TP4  PTR1B1,27  [B1,27]
TP5  PTR1B1,27  [B1,27]
TP6  PTR1B1,27  [B1,27]
TP7  PTR1B1,27  [B1,27]
TP8  PTR1B1,27  [B1,27]
TP9  PTR1B1,27  [B1,27]
TP10  PTR1B1,27  [B1,27]
TP11  PTR1B1,27  [B1,27]
U$11  GNDPAD_4MM  [GNDPAD]
U$12  GNDPAD_4MM  [GNDPAD]
U$13  GNDPAD_4MM  [GNDPAD]
U$14  GNDPAD_4MM  [GNDPAD]
U$15  GNDPAD_4MM  [GNDPAD]
U$16  GNDPAD_4MM  [GNDPAD]
U$17  GNDPAD_4MM  [GNDPAD]
U$18  GNDPAD_4MM  [GNDPAD]

### Nets
+5V: C34.+ C51.+ C52.+ C53.+ C54.+ C55.+ C56.+ C57.+ CH1.P2 CH2.P2 CH3.P2 CH4.P2 CH5.P2 CH6.P2 CH7.P2 CH8.P2 TP10.TP TP11.TP ; also sheet 1,3
CH1_TIA: CH1.P3 ; also sheet 4
CH1_TIB: CH1.P5 ; also sheet 4
CH1_TIC: CH1.P7 ; also sheet 4
CH1_TOA: CH1.P4 ; also sheet 4
CH1_TOB: CH1.P6 ; also sheet 4
CH1_TOC: CH1.P8 ; also sheet 4
CH2_TIA: CH2.P3 ; also sheet 4
CH2_TIB: CH2.P5 ; also sheet 4
CH2_TIC: CH2.P7 ; also sheet 4
CH2_TOA: CH2.P4 ; also sheet 4
CH2_TOB: CH2.P6 ; also sheet 4
CH2_TOC: CH2.P8 ; also sheet 4
CH3_TIA: CH3.P3 ; also sheet 4
CH3_TIB: CH3.P5 ; also sheet 4
CH3_TIC: CH3.P7 ; also sheet 4
CH3_TOA: CH3.P4 ; also sheet 4
CH3_TOB: CH3.P6 ; also sheet 4
CH3_TOC: CH3.P8 ; also sheet 4
CH4_TIA: CH4.P3 ; also sheet 4
CH4_TIB: CH4.P5 ; also sheet 4
CH4_TIC: CH4.P7 ; also sheet 4
CH4_TOA: CH4.P4 ; also sheet 4
CH4_TOB: CH4.P6 ; also sheet 4
CH4_TOC: CH4.P8 ; also sheet 4
CH5_TIA: CH5.P3 ; also sheet 4
CH5_TIB: CH5.P5 ; also sheet 4
CH5_TIC: CH5.P7 ; also sheet 4
CH5_TOA: CH5.P4 ; also sheet 4
CH5_TOB: CH5.P6 ; also sheet 4
CH5_TOC: CH5.P8 ; also sheet 4
CH6_TIA: CH6.P3 ; also sheet 4
CH6_TIB: CH6.P5 ; also sheet 4
CH6_TIC: CH6.P7 ; also sheet 4
CH6_TOA: CH6.P4 ; also sheet 4
CH6_TOB: CH6.P6 ; also sheet 4
CH6_TOC: CH6.P8 ; also sheet 4
CH7_TIA: CH7.P3 ; also sheet 4
CH7_TIB: CH7.P5 ; also sheet 4
CH7_TIC: CH7.P7 ; also sheet 4
CH7_TOA: CH7.P4 ; also sheet 4
CH7_TOB: CH7.P6 ; also sheet 4
CH7_TOC: CH7.P8 ; also sheet 4
CH8_TIA: CH8.P3 ; also sheet 4
CH8_TIB: CH8.P5 ; also sheet 4
CH8_TIC: CH8.P7 ; also sheet 4
CH8_TOA: CH8.P4 ; also sheet 4
CH8_TOB: CH8.P6 ; also sheet 4
CH8_TOC: CH8.P8 ; also sheet 4
CLK: TP3.TP ; also sheet 2
GND: C34.- C51.- C52.- C53.- C54.- C55.- C56.- C57.- CH1.P1 CH2.P1 CH3.P1 CH4.P1 CH5.P1 CH6.P1 CH7.P1 CH8.P1 JP1.1 JP2.1 JP3.1 JP4.1 TP7.TP TP8.TP TP9.TP U$11.P$1 U$12.P$1 U$13.P$1 U$14.P$1 U$15.P$1 U$16.P$1 U$17.P$1 U$18.P$1 ; also sheet 1,2,3,4
RX0: TP2.TP ; also sheet 2,3
TX0: TP1.TP ; also sheet 2,3
VA3CORE_1V5: TP5.TP ; also sheet 1,2
VA3IO_3V3: TP4.TP ; also sheet 1,2
VLPC_3V3: TP6.TP ; also sheet 1,2,3,4

## Library data of the parts
C1 C2 C19 C31 C32 C34-C36 C51-C57 = rcl:CPOL-EU: POLARIZED CAPACITOR, European symbol
C3-C18 C20-C30 C33 C37-C50 = rcl:C-EU: CAPACITOR, European symbol
CH1-CH8 = krake-rj45:955XX-8
FT230X = ftx:SERIAL_FT230XQ
H1-H4 = holes:MOUNT-HOLE: MOUNTING HOLE with drill center marker
HCH1-HCH8 = con-lstb:MA07-2: PIN HEADER; OC_FARNELL: unknown; OC_NEWARK: unknown
IC1 = lpc1xxx-v6:LPC1765: LPC1765 100 MHz 32-bit ARM Cortex-M3 based microcontroller featuring a high level of integration and low power consumption. 256 kB Flash, 64 kB SRAM, USB Device/Host/OTG, 2 CAN, DAC MarcVl - Datasheet available on www.nxp.com
IC2 = actel-proasic3:PROASIC3_NANO_A3PN125: ProASIC3 nano A3PN125 ProASIC3, the third-generation family of Microsemi flash FPGAs, offers performance, density, and features beyond those of the ProASICPLUS® family. Nonvolatile flash technology gives ProASIC3 nano devices the advantage of being a secure, low power, single-chip solution that is live at power-up (LAPU). ProASIC3 nano devices are reprogrammable and offer time-to-market benefits at an ASIC-level unit cost. These features enable designers to create high-density systems using existing ASIC or FPGA design flows and tools. ProASIC3 nano devices offer 1 kbit of on-chip, reprogrammable, nonvolatile FlashROM storage as well as clock conditioning circuitry based on an integrated phase-locked loop (PLL). A3PN030 and smaller devices do not have PLL or RAM support. ProASIC3 nano devices have up to 250,000 system gates, supported with up to 36 kbits of true dual-port SRAM and up to 71 user I/Os. ProASIC3 nano devices increase the breadth of the ProASIC3 product line by adding new features and packages for greater customer value in high volume consumer, portable, and battery-backed markets. Added features include smaller footprint packages designed with two-layer PCBs in mind, low power, hot-swap capability, and Schmitt trigger for greater flexibility in low-cost and power-sensitive applications. Copyright (C) 2013, Thorsten Schroeder <ths at modzero dot ch> Germany, Berlin This file will be published under a less restrictive opensource license.
ISP RESET = devio:B3U-1000P: Ultra-small Tactile Switch (SMT) Ultra-small-sized Tactile Switch with High Contact Reliability: 1.2 × 3 × 2.5 mm (H × W × D) ? Compact switch allows high-density mounting on PCBs for mobile equipment. ? Dust-proof construction provides high reliability in dusty environments. ? Surface mounted: Ideal for high-density mounting. ? Models with ground terminals are available for protection against static electricity.
JP1-JP4 = pinhead:PINHD-1X1: PIN HEADER
JTAG_A3PN = pinhead-2:PINHD-2X05: PIN HEADER
JTAG_LPC = pinhead-2:PINHD-2X10: PIN HEADER
L1 = wuerth-elektronik:WE-KI: SMD Wire Wound Ceramic Inductor WE-KI - Wire wound - High thermal stability - Rated current up to 1 A - High Q-factor - High SRF -- Especially developed for high frequency applications -- Perfect for applications in telecommunications -- Bluetooth -- Wireless LAN
L2-L4 = devio:VLS201610E: Inductors for Power Circuits Wound/STD • magnetic shielded VLS series Type: VLS201610E VLS201612E VLS2010E VLS2012E VLS252008E VLS252010E VLS252012E VLS252015E VLS3010E VLS3012E VLS3015E VLS4012E http://www.tdk.co.jp/tefe02/e531_vls.pdf Digikey: 445-6611-1-ND
LED1-LED4 PWR_UP = led:LED: LED OSRAM: - CHIPLED LG R971, LG N971, LY N971, LG Q971, LY Q971, LO R971, LY R971 LH N974, LH R974 LS Q976, LO Q976, LY Q976 LO Q996 - Hyper CHIPLED LW Q18S LB Q993, LB Q99A, LB R99A - SideLED LS A670, LO A670, LY A670, LG A670, LP A670 LB A673, LV A673, LT A673, LW A673 LH A674 LY A675 LS A676, LA A676, LO A676, LY A676, LW A676 LS A679, LY A679, LG A679 - Hyper Micro SIDELED® LS Y876, LA Y876, LO Y876, LY Y876 LT Y87S - SmartLED LW L88C, LW L88S LB L89C, LB L89S, LG L890 LS L89K, LO L89K, LY L89K LS L896, LA L896, LO L896, LY L896 - TOPLED LS T670, LO T670, LY T670, LG T670, LP T670 LSG T670, LSP T670, LSY T670, LOP T670, LYG T670 LG T671, LOG T671, LSG T671 LB T673, LV T673, LT T673, LW T673 LH T674 LS T676, LA T676, LO T676, LY T676, LB T676, LH T676, LSB T676, LW T676 LB T67C, LV T67C, LT T67C, LS T67K, LO T67K, LY T67K, LW E67C LS E67B, LA E67B, LO E67B, LY E67B, LB E67C, LV E67C, LT E67C LW T67C LS T679, LY T679, LG T679 LS T770, LO T770, LY T770, LG T770, LP T770 LB T773, LV T773, LT T773, LW T773 LH T774 LS E675, LA E675, LY E675, LS T675 LS T776, LA T776, LO T776, LY T776, LB T776 LHGB T686 LT T68C, LB T68C - Hyper Mini TOPLED® LB M676 - Mini TOPLED Santana® LG M470 LS M47K, LO M47K, LY M47K Source: http://www.osram.convergy.de LUXEON: - LUMILED® LXK2-PW12-R00, LXK2-PW12-S00, LXK2-PW14-U00, LXK2-PW14-V00 LXK2-PM12-R00, LXK2-PM12-S00, LXK2-PM14-U00 LXK2-PE12-Q00, LXK2-PE12-R00, LXK2-PE12-S00, LXK2-PE14-T00, LXK2-PE14-U00 LXK2-PB12-K00, LXK2-PB12-L00, LXK2-PB12-M00, LXK2-PB14-N00, LXK2-PB14-P00, LXK2-PB14-Q00 LXK2-PR12-L00, LXK2-PR12-M00, LXK2-PR14-Q00, LXK2-PR14-R00 LXK2-PD12-Q00, LXK2-PD12-R00, LXK2-PD12-S00 LXK2-PH12-R00, LXK2-PH12-S00 LXK2-PL12-P00, LXK2-PL12-Q00, LXK2-PL12-R00 Source: www.luxeon.com KINGBRIGHT: KA-3528ASYC Source: www.kingbright.com
LM1 LM2 LM3671 = Labor:LM3671: LM3671 2MHz, 600mA Step-Down DC-DC Converter
Q1 = crystal:CRYSTAL: CRYSTAL; OC_FARNELL: unknown; OC_NEWARK: unknown
R1-R15 R19-R71 R83 R84 = rcl:R-EU_: RESISTOR, European symbol
R16-R18 = resistor:R-EU_: RESISTOR, European symbol
TP1-TP11 = testpad:PTR1: TEST PIN
U$3-U$10 = krake-rj45:NVT2006
U$11-U$18 = krake-power:GNDPAD_4MM
X1 = SparkFun:USB: USB Connectors USB-B-PTH is fully proven SKU : PRT-00139 USB-miniB is fully proven SKU : PRT-00587 USB-A-PCB is untested. USB-A-H is throughly reviewed, but untested. Spark Fun Electronics SKU : PRT-00437 USB-B-SMT is throughly reviewed, but untested. Needs silkscreen touching up. USB-A-S has not been used/tested USB-MB-H has not been used/tested